# Altium project labrador.PrjPCB
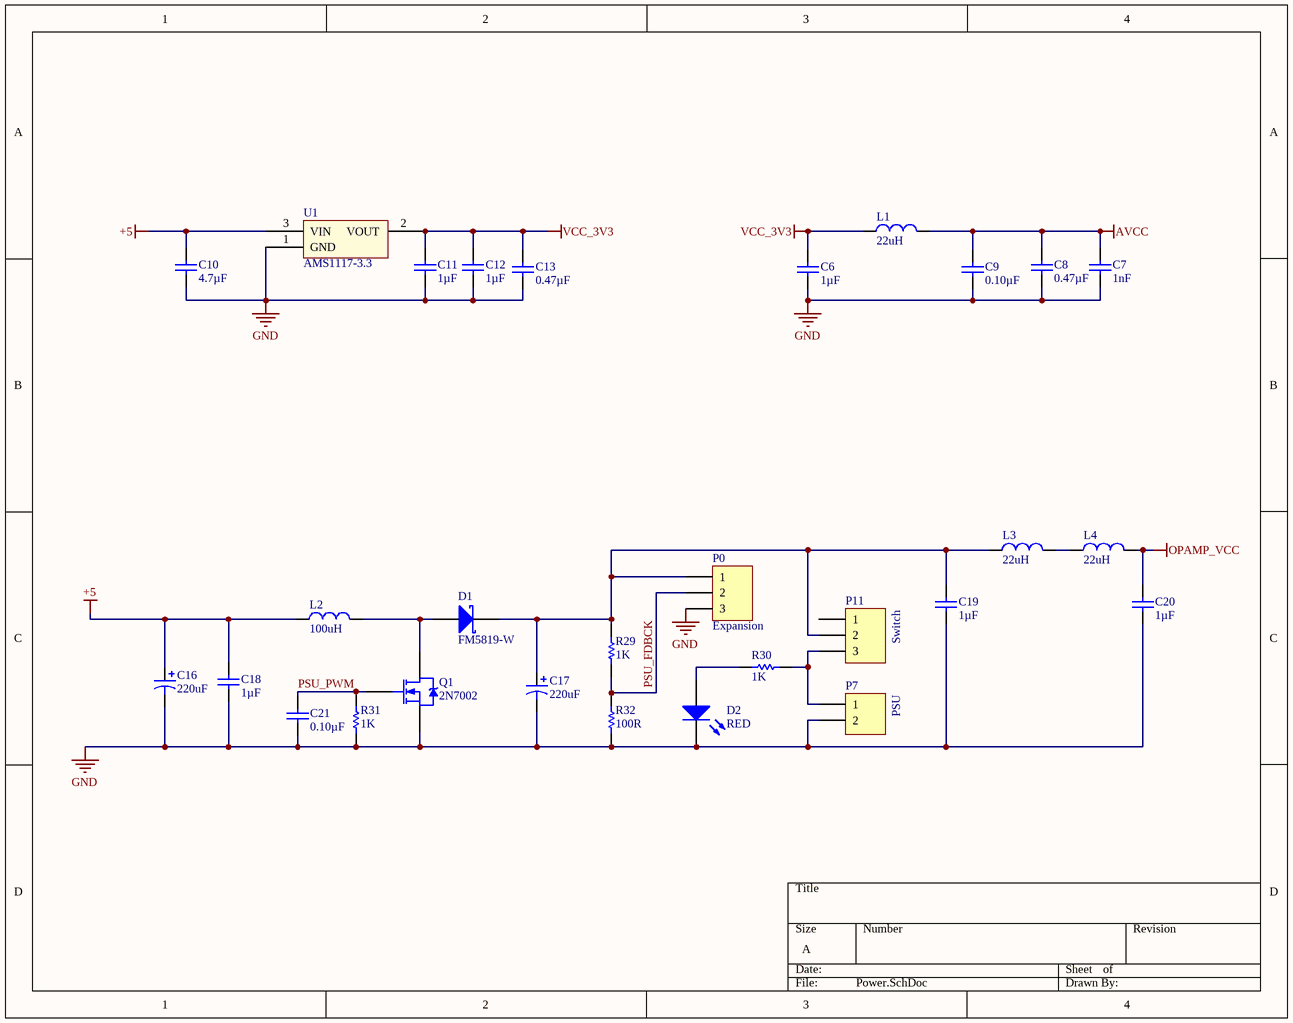
[diagram p0: Power.SchDoc]
3 sheets, 76 parts. Net scope: global (net labels, ports and power ports of the same name join across sheets).
Board file: PCB.PcbDoc
Sheets:
  Power.SchDoc
  Labrador.SchDoc
  Analog.SchDoc

## Sheet Power.SchDoc
size A

### Parts
C6  1µF  [CAPC200X125X75L45N]
C7  1nF  [CAPC200X125X75L45N]
C8  0.47µF  [CAPC200X125X75L45N]
C9  0.10µF  [CAPC200X125X75L45N]
C10  4.7µF  [CAPC200X125X75L45N]
C11  1µF  [CAPC200X125X75L45N]
C12  1µF  [CAPC200X125X75L45N]
C13  0.47µF  [CAPC200X125X75L45N]
C16  value 220uF  [Cap_Elec_47uF]  (hidden comment: CAP_POLAR)
C17  value 220uF  [Cap_Elec_47uF]  (hidden comment: CAP_POLAR)
C18  1µF  [CAPC200X125X75L45N]
C19  1µF  [CAPC200X125X75L45N]
C20  1µF  [CAPC200X125X75L45N]
C21  0.10µF  [CAPC200X125X75L45N]
D1  FM5819-W  [DIOM470X266X220L114X139N]
D2  RED  [LEDC200X125X38L45N]
L1  22uH  [CAPC200X125X140L45N]
L2  100uH  [CD54-Modified]
L3  22uH  [CAPC200X125X140L45N]
L4  22uH  [CAPC200X125X140L45N]
P0  Expansion  [HDR1X3]
P7  PSU  [HDR1X2]
P11  Switch  [HDR1X3]
Q1  2N7002  [SOT23-3P95_230X110L30X43N]
R29  1K  [RESC200X125X50L35N]
R30  1K  [RESC200X125X50L35N]
R31  1K  [RESC200X125X50L35N]
R32  100R  [RESC200X125X50L35N]
U1  AMS1117-3.3  [SOT223-4P229_700X180L36X74N]

### Nets
+5: C10.2 C16.2 C18.2 L2.1 U1.3(VIN)
AVCC: C7.2 C8.2 C9.2 L1.2
GND: C6.1 C7.1 C8.1 C9.1 C10.1 C11.1 C12.1 C13.1 C16.1 C17.1 C18.1 C19.1 C20.1 C21.1 D2.C(K) P0.3 P7.2 Q1.2(S) R31.1 R32.1 U1.1(GND)
OPAMP_VCC: C20.2 L4.2
VCC_3V3: C6.2 C11.2 C12.2 C13.2 L1.1 U1.2(VOUT)
PSU_FDBCK: P0.2 R29.1 R32.2
PSU_PWM: C21.2 Q1.1(G) R31.2
NetC17_2: C17.2 C19.2 D1.C L3.1 P0.1 P11.2 R29.2
NetD1_A: D1.A L2.2 Q1.3(D)
NetD2_A: D2.A R30.1
NetL3_2: L3.2 L4.1
NetP7_1: P7.1 P11.3 R30.2

Not connected (* = marked no-connect by the designer): P11 1

### Library data of the parts
C6 C11 C12 C18-C20 = 885012107015: 1µF 25V Ceramic Capacitor X5R 0805 (2012 Metric) 0.079" L x 0.049" W (2.00mm x 1.25mm); Manufacturer: Wurth Electronics; Capacitance: 1uF; Tolerance: 20%; Supplier 1: Farnell; Manufacturer Part Number: 885012107015; Stock 1: 0; Mount: Surface Mount; Case/Package: 0805; Case Code (Metric): 2012; Case Code (Imperial): 0805; Min Operating Temperature: -55°C; Max Operating Temperature: 85°C; Packaging: Tape and Reel; Voltage Rating: 25V; Length: 0.079inch; Width: 0.049inch; Thickness: 0.053inch
C7 = 885012207033: 1000pF 16V Ceramic Capacitor X7R 0805 (2012 Metric) 0.079" L x 0.049" W (2.00mm x 1.25mm); Manufacturer: Wurth Electronics; Tolerance: 10%; Supplier 1: Newark; Manufacturer Part Number: 885012207033; Stock 1: 3260; Pricing 1: 10=0.035, 25=0.034, 50=0.032, 100=0.031, 250=0.03, 500=0.028 (USD); Mount: Surface Mount; Case/Package: 0805; Case Code (Metric): 2012; Case Code (Imperial): 0805; Min Operating Temperature: -55°C; Max Operating Temperature: 125°C; Packaging: Tape and Reel; Capacitance: 1nF; Voltage Rating: 16V; Length: 0.079inch; Width: 0.049inch; Thickness: 0.035inch
C8 C13 = 885012207020: 0.47µF 10V Ceramic Capacitor X7R 0805 (2012 Metric) 0.079" L x 0.049" W (2.00mm x 1.25mm); Manufacturer: Wurth Electronics; Capacitance: 470nF; Tolerance: 10%; Supplier 1: Newark; Manufacturer Part Number: 885012207020; Stock 1: 2295; Pricing 1: 5=0.11, 10=0.098, 25=0.095, 50=0.091, 100=0.088, 250=0.083, 500=0.078 (USD); Mount: Surface Mount; Case/Package: 0805; Case Code (Metric): 2012; Case Code (Imperial): 0805; Min Operating Temperature: -55°C; Max Operating Temperature: 125°C; Packaging: Tape and Reel; Voltage Rating: 10V; Length: 0.079inch; Width: 0.049inch; Thickness: 0.053inch
C9 C21 = 885012207016: 0.10µF 10V Ceramic Capacitor X7R 0805 (2012 Metric) 0.079" L x 0.049" W (2.00mm x 1.25mm); Manufacturer: Wurth Electronics; Capacitance: 100nF; Tolerance: 10%; Supplier 1: Mouser; Manufacturer Part Number: 885012207016; Stock 1: 13980; Pricing 1: 1=0.1, 10=0.045, 50=0.045, 100=0.04, 1000=0.035, 10000=0.035 (USD); Mount: Surface Mount; Case/Package: 0805; Case Code (Metric): 2012; Case Code (Imperial): 0805; Min Operating Temperature: -55°C; Max Operating Temperature: 125°C; Packaging: Cut Tape; Voltage Rating: 10V; Length: 0.079inch; Width: 0.049inch; Thickness: 0.035inch
C10 = 885012107013: 4.7µF 16V Ceramic Capacitor X5R 0805 (2012 Metric) 0.079" L x 0.049" W (2.00mm x 1.25mm); Manufacturer: Wurth Electronics; Capacitance: 4.7uF; Tolerance: 20%; Supplier 1: Farnell; Manufacturer Part Number: 885012107013; Stock 1: 0; Mount: Surface Mount; Case/Package: 0805; Case Code (Metric): 2012; Case Code (Imperial): 0805; Min Operating Temperature: -55°C; Max Operating Temperature: 85°C; Packaging: Tape and Reel; Voltage Rating: 16V; Length: 0.079inch; Width: 0.049inch; Thickness: 0.057inch
C16 C17 = CAP_POLAR: Aluminium Electrolyte 16V max
D1 = FM5819-W: Schottky Diodes & Rectifiers Vr/40V Io/1A T/R; Manufacturer: Rectron; Max Surge Current: 25A; Element Configuration: Single; Max Reverse Leakage Current: 200uA; Supplier 1: Mouser; Manufacturer Part Number: FM5819-W; Stock 1: 20026; Pricing 1: 1=0.15, 10=0.15, 50=0.13, 100=0.1, 1000=0.072, 10000=0.042 (USD); Min Operating Temperature: -55°C; Max Operating Temperature: 150°C; Package Quantity: 5000; Packaging: Tape and Reel
D2 = LH R974-LP-1: LED RED DIFFUSED 0805 SMD; Manufacturer: OSRAM Opto Semiconductors Inc.; Lens Color: White; Millicandela Rating: 41mcd; Lens Style/Size: Rectangle with Flat Top, 1.30mm x 1.25mm; Voltage - Forward (Vf) (Typ): 1.8V; Current - Test: 20mA; Viewing Angle: 160°; Wavelength - Dominant: 645nm; Wavelength - Peak: 660nm; Supplier 1: Digi-Key; Manufacturer Part Number: LH R974-LP-1; RoHS: RoHS Compliant; Category: Optoelectronics; Stock 1: 128309; Pricing 1: 1=0.25, 10=0.18, 25=0.1328, 100=0.0948, 250=0.06448, 500=0.0569, 1000=0.04457 (USD); Packaging: Cut Tape (CT); Part Status: Active; Color: Red; Lens Transparency: Diffused; Mounting Type: Surface Mount; Features: -; Package / Case: 0805 (2012 Metric); Size / Dimension: 2.00mm L x 1.25mm W; Height (Max): 0.90mm; ComponentLink1URL: http://www.osram-os.com/Graphics/XPic8/00078869_0.pdf; ComponentLink1Description: http://www.osram-os.com/Graphics/XPic8/00078869_0.pdf
L1 L3 L4 = LBC2016T220M: Fixed Inductor 22uH 20% 165mA; Supplier 1: Arrow
L2 = CD75NP-331KC: FIXED IND 100uH 400MA 1.26 OHM; Manufacturer: Sumida America Components Inc.; Material - Core: Ferrite; Inductance: 330µH; Tolerance: ±10%; Shielding: Unshielded; DC Resistance (DCR): 1.26 Ohm Max; Supplier 1: Digi-Key; Manufacturer Part Number: CD75NP-331KC; RoHS: RoHS Compliant; Category: Inductors, Coils, Chokes; Stock 1: 0; Pricing 1: 500=0.504 (USD); Packaging: Tape & Reel (TR); Part Status: Active; Type: -; Current Rating: 400mA; Current - Saturation: -; Q @ Freq: -; Frequency - Self Resonant: -; Ratings: -; Operating Temperature: -40°C ~ 100°C; Mounting Type: Surface Mount; Package / Case: Nonstandard; Supplier Device Package: -; Size / Dimension: 0.307" L x 0.276" W (7.80mm x 7.00mm); Height - Seated (Max): 0.217" (5.50mm); ComponentLink1URL: http://products.sumida.com/products/pdf/CD75.pdf; ComponentLink1Description: http://products.sumida.com/products/pdf/CD75.pdf
P0 P11 = Header 3: Header, 3-Pin; LatestRevisionDate: 17-Jul-2002; LatestRevisionNote: Re-released for DXP Platform.; Publisher: Altium Limited
P7 = Header 2: Header, 2-Pin; LatestRevisionDate: 17-Jul-2002; LatestRevisionNote: Re-released for DXP Platform.; Publisher: Altium Limited
Q1 = 2N7002LT1G: MOSFET N-CH 60V 0.115A SOT-23; Manufacturer: ON Semiconductor; FET Type: N-Channel; Current - Continuous Drain (Id) @ 25°C: 115mA (Tc); Drive Voltage (Max Rds On,  Min Rds On): 5V, 10V; Vgs(th) (Max) @ Id: 2.5V @ 250µA; Input Capacitance (Ciss) (Max) @ Vds: 50pF @ 25V; Vgs (Max): ±20V; Power Dissipation (Max): 225mW (Ta); Rds On (Max) @ Id, Vgs: 7.5 Ohm @ 500mA, 10V; Supplier 1: Digi-Key; Manufacturer Part Number: 2N7002LT1G; RoHS: RoHS Compliant; Category: Discrete Semiconductor Products; Stock 1: 446807; Pricing 1: 1=0.14, 10=0.129, 100=0.0704, 500=0.0433, 1000=0.02952 (USD); Packaging: Cut Tape (CT); Part Status: Active; Technology: MOSFET (Metal Oxide); Drain to Source Voltage (Vdss): 60V; Gate Charge (Qg) (Max) @ Vgs: -; FET Feature: -; Operating Temperature: -55°C ~ 150°C (TJ); Mounting Type: Surface Mount; Supplier Device Package: SOT-23-3 (TO-236); Package / Case: TO-236-3, SC-59, SOT-23-3; ComponentLink1URL: http://www.onsemi.com/pub_link/Collateral/2N7002L-D.PDF; ComponentLink1Description: http://www.onsemi.com/pub_link/Collateral/2N7002L-D.PDF
R29-R31 = RC0805FR-071KL: RES SMD 1K OHM 1% 1/8W 0805; Manufacturer: Yageo; Power (Watts): 0.125W, 1/8W; Temperature Coefficient: ±100ppm/°C; Supplier 1: Digi-Key; Manufacturer Part Number: RC0805FR-071KL; RoHS: RoHS Compliant; Category: Resistors; Stock 1: 6960895; Pricing 1: 1=0.1, 10=0.019, 25=0.0136, 50=0.0104, 100=0.0077, 250=0.00584, 500=0.00468, 1000=0.00345 (USD); Packaging: Cut Tape (CT); Part Status: Active; Resistance (Ohms): 1k; Tolerance: ±1%; Composition: Thick Film; Features: Moisture Resistant; Operating Temperature: -55°C ~ 155°C; Package / Case: 0805 (2012 Metric); Supplier Device Package: 0805; Size / Dimension: 0.079" L x 0.049" W (2.00mm x 1.25mm); Height - Seated (Max): 0.024" (0.60mm); Number of Terminations: 2; Failure Rate: -; ComponentLink1URL: http://www.yageo.com/NewPortal/yageodocoutput?fileName=/pdf/R-Chip/PYu-RC_Group_51_RoHS_L_4.pdf; ComponentLink1Description: http://www.yageo.com/NewPortal/yageodocoutput?fileName=/pdf/R-Chip/PYu-RC_Group_51_RoHS_L_4.pdf
R32 = RC0805JR-07100RL: YAGEO         RC0805JR-07100RL             RES, THICK FILM, 100R, 5%, 0.125W, 0805; Temperature Coefficient: 100ppm/°C; Power Rating: 125mW; Voltage Rating: 150V; Supplier 1: Future Electronics; Manufacturer: Yageo; Manufacturer Part Number: RC0805JR-07100RL; Stock 1: 0; Case/Package: 0805; Contact Plating: Lead,Matte,Tin; Case Code (Imperial): 0805; Case Code (Metric): 2012; Min Operating Temperature: -55°C; Max Operating Temperature: 155°C; Tolerance: 5%; Resistance: 100R; Composition: Thick Film; Packaging: Tape and Reel; Termination: SMD/SMT; Radiation Hardening: No; REACH SVHC: Unknown; Lead Free: Lead Free; ComponentLink1URL: http://www.farnell.com/datasheets/444164.pdf; ComponentLink1Description: http://www.farnell.com/datasheets/444164.pdf; ComponentLink2URL: http://www.farnell.com/datasheets/2167052.pdf; ComponentLink2Description: http://www.farnell.com/datasheets/2167052.pdf; ComponentLink3URL: http://www.farnell.com/datasheets/442941.pdf; ComponentLink3Description: http://www.farnell.com/datasheets/442941.pdf; ComponentLink4URL: http://www.yageo.ru/pdf/RC0805.pdf; ComponentLink4Description: http://www.yageo.ru/pdf/RC0805.pdf
U1 = AMS1117-3.3: Linear Reg 3.3, 1.2V dropout

## Sheet Labrador.SchDoc
size A
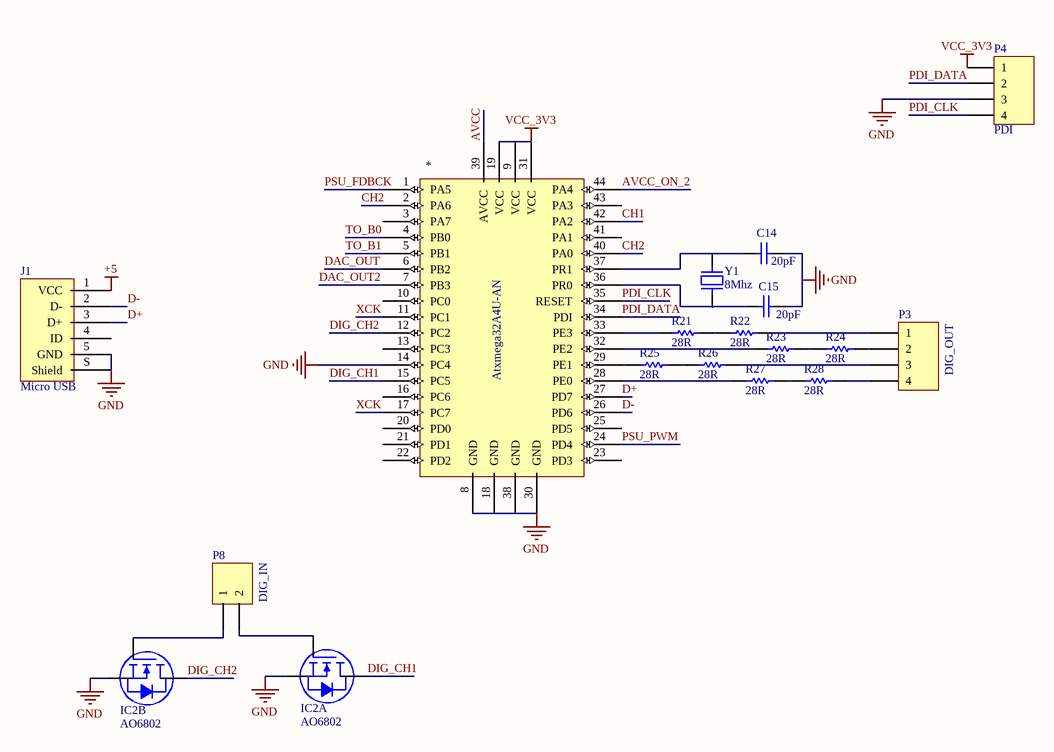
[diagram p1: Labrador.SchDoc]

### Parts
*  Atxmega32A4U-AN  [QFP44P80_1200X1200X120L60X37N]
C14  20pF  [CAPC200X125X75L45N]
C15  20pF  [CAPC200X125X75L45N]
IC2  AO6802  [ALPHAOMEGA TSOP-6]  (parts A,B of 2)
J1  Micro USB  [FCI USB 10118193-0001LF]
P3  DIG_OUT  [HDR1X4]
P4  PDI  [HDR1X4]
P8  DIG_IN  [HDR1X2]
R21  28R  [RESC160X80X55L25N]
R22  28R  [RESC160X80X55L25N]
R23  28R  [RESC160X80X55L25N]
R24  28R  [RESC160X80X55L25N]
R25  28R  [RESC160X80X55L25N]
R26  28R  [RESC160X80X55L25N]
R27  28R  [RESC160X80X55L25N]
R28  28R  [RESC160X80X55L25N]
Y1  8Mhz  [TXC 9C]

### Nets
+5: J1.1(VCC)
AVCC: *.39(AVCC)
GND: *.8(GND) *.14(PC4) *.18(GND) *.30(GND) *.38(GND) C14.2 C15.2 IC2.2(S2) IC2.5(S1) J1.5(GND) J1.S(Shield) P4.3
VCC_3V3: *.9(VCC) *.19(VCC) *.31(VCC) P4.1
AVCC_ON_2: *.44(PA4)
CH1: *.42(PA2)
CH2: *.2(PA6) *.40(PA0)
D+: *.27(PD7) J1.3(D+)
D-: *.26(PD6) J1.2(D-)
DAC_OUT: *.6(PB2)
DAC_OUT2: *.7(PB3)
DIG_CH1: *.15(PC5) IC2.6(D1)
DIG_CH2: *.12(PC2) IC2.4(D2)
PDI_CLK: *.35(RESET) P4.4
PDI_DATA: *.34(PDI) P4.2
PSU_FDBCK: *.1(PA5)
PSU_PWM: *.24(PD4)
TO_B0: *.4(PB0)
TO_B1: *.5(PB1)
XCK: *.11(PC1) *.17(PC7)
Net*_28: *.28(PE0) R27.1
Net*_29: *.29(PE1) R25.1
Net*_32: *.32(PE2) R23.1
Net*_33: *.33(PE3) R21.1
Net*_36: *.36(PR0) C15.1 Y1.1
Net*_37: *.37(PR1) C14.1 Y1.2
NetIC2_1: IC2.1(G1) P8.2
NetIC2_3: IC2.3(G2) P8.1
NetP3_1: P3.1 R22.2
NetP3_2: P3.2 R24.2
NetP3_3: P3.3 R26.2
NetP3_4: P3.4 R28.2
NetR21_2: R21.2 R22.1
NetR23_2: R23.2 R24.1
NetR25_2: R25.2 R26.1
NetR27_2: R27.2 R28.1

Not connected (* = marked no-connect by the designer): * 3(PA7) 10(PC0) 13(PC3) 16(PC6) 20(PD0) 21(PD1) 22(PD2) 23(PD3) 25(PD5) 41(PA1) 43(PA3); J1 4(ID)

### Library data of the parts
C14 C15 = CL21C180JBANNNC: CAP CER 20PF 50V NP0 0805; Manufacturer: Samsung Electro-Mechanics America, Inc.; Capacitance: 18pF; Tolerance: ±5%; Temperature Coefficient: C0G, NP0; Supplier 1: Digi-Key; Manufacturer Part Number: CL21C180JBANNNC; RoHS: RoHS Compliant; Category: Capacitors; Stock 1: 151885; Pricing 1: 1=0.1, 10=0.044, 25=0.032, 50=0.024, 100=0.0196, 250=0.0164, 500=0.014, 1000=0.011 (USD); Packaging: Digi-Reel®; Part Status: Active; Voltage - Rated: 50V; Operating Temperature: -55°C ~ 125°C; Features: -; Ratings: -; Applications: General Purpose; Mounting Type: Surface Mount, MLCC; Package / Case: 0805 (2012 Metric); Size / Dimension: 0.079" L x 0.049" W (2.00mm x 1.25mm); Height - Seated (Max): -; Thickness (Max): 0.030" (0.75mm); Lead Spacing: -; Lead Style: -; ComponentLink1URL: http://www.samsungsem.com/kr/support/product-search/mlcc/__icsFiles/afieldfile/2016/08/18/S_CL21C180JBANNNC.pdf; ComponentLink1Description: http://www.samsungsem.com/kr/support/product-search/mlcc/__icsFiles/afieldfile/2016/08/18/S_CL21C180JBANNNC.pdf; Supplier Part Number 1: 1276-1107-6-ND
IC2 = ALPHAOMEGA TSOP-6: MOSFET 2N-CH 30V 3.5A 6-TSOP; Manufacturer: Alpha & Omega; Rds On (Max) at Id, Vgs: 50 mOhm @ 3.5A, 10V; Vgs(th) (Max) at Id: 2.5V @ 250µA; Gate Charge (Qg): 5nC @ 10V; Input Capacitance (Ciss) at Vds: 210pF @ 15V; Power - Max: 1.15W; Part Number: AO6802; PartId: 9696; Supplier 1: Digi-Key; Supplier Part Number 1: 785-1082-1-ND; ComponentLink1Description: Datasheet; ComponentLink1URL: http://aosmd.com/res/data_sheets/AO6802.pdf; ComponentLink2Description: Digi-Key Listing; ComponentLink2URL: https://www.digikey.com/product-detail/en/alpha-omega-semiconductor-inc/AO6802/785-1082-1-ND/1856025; Price: 0.17; Type: 2 N-Channel (Dual); Device Package: SC-74, SOT-457; Drain to Source Voltage (Vdss): 30V; Features: Logic Level Gate; Current Continuous Drain: 3.5A
J1 = USB 2.0 Type B Micro: CONN USB MICRO B RECPT SMT R/A; Part Number: 10118193-0001LF; Manufacturer: FCI; Number Of Positions: 5; PartId: 7864; Supplier 1: Digi-Key; Supplier Part Number 1: 609-4616-2-ND; ComponentLink1Description: Datasheet; ComponentLink1URL: http://portal.fciconnect.com/Comergent//fci/drawing/10118193.pdf; ComponentLink2Description: Digi-Key Listing; ComponentLink2URL: http://www.digikey.ca/product-detail/en/10118193-0001LF/609-4616-2-ND/2785388; Price: 0.2823; Type: USB - micro B; Series: USB 2.0
P3 P4 = Header 4: Header, 4-Pin; LatestRevisionDate: 17-Jul-2002; LatestRevisionNote: Re-released for DXP Platform.; Publisher: Altium Limited
P8 = Header 2: Header, 2-Pin; LatestRevisionDate: 17-Jul-2002; LatestRevisionNote: Re-released for DXP Platform.; Publisher: Altium Limited
R21-R28 = RC0603FR-0728RL: RES SMD 28 OHM 1% 1/10W 0603; Manufacturer: Yageo; Temperature Coefficient: 100ppm/°C; Power Rating: 100mW; Voltage Rating: 50V; Supplier 1: Future Electronics; Manufacturer Part Number: RC0603FR-0728RL; Stock 1: 0; Case/Package: 0603; Contact Plating: Matte,Tin; Case Code (Metric): 1608; Case Code (Imperial): 0603; Min Operating Temperature: -55°C; Max Operating Temperature: 155°C; Resistance: 28R; Tolerance: 1%; Composition: Thick Film; Package Quantity: 1; Packaging: Tape and Reel; Number of Terminations: 2; Termination: SMD/SMT; Military Standard: Not; Max Power Dissipation: 100mW; Voltage Rating (DC): 50V; Features: Moisture Resistant; Length: 0.063inch; Height: 0.022inch; Width: 0.031inch; Depth: 0.8mm; Lead Free: Lead Free; ComponentLink1URL: http://www.yageo.com/documents/recent/PYu-RC_Group_51_RoHS_L_9.pdf; ComponentLink1Description: http://www.yageo.com/documents/recent/PYu-RC_Group_51_RoHS_L_9.pdf; ComponentLink2URL: http://www.yageo.com/documents/recent/PYu-RC0603_51_RoHS_L_4.pdf; ComponentLink2Description: http://www.yageo.com/documents/recent/PYu-RC0603_51_RoHS_L_4.pdf
Y1 = ATS08ASM-1: Crystals 8MHz 20pF; Manufacturer: CTS; Frequency Tolerance: 30ppm; ESR (Equivalent Series Resistance): 60R; Frequency Stability: 50ppm; Supplier 1: Future Electronics; Manufacturer Part Number: ATS08ASM-1; Stock 1: 0; Mount: Surface Mount; Min Operating Temperature: -20°C; Max Operating Temperature: 70°C; Frequency: 8MHz; Load Capacitance: 20pF; Packaging: Tape and Reel; Series Resistance: 60R; Package Quantity: 1000; Tolerance: 30ppm; Termination: SMD/SMT; Length: 0.437inch; Height: 0.169inch; Width: 4.83mm; Radiation Hardening: No; Lead Free: Lead Free; ComponentLink1URL: http://www.ctscorp.com/wp-content/uploads/ATS-ATSSM.pdf; ComponentLink1Description: http://www.ctscorp.com/wp-content/uploads/ATS-ATSSM.pdf; ComponentLink2URL: https://www.ctscorp.com/wp-content/uploads/ATS-ATSSM.pdf; ComponentLink2Description: https://www.ctscorp.com/wp-content/uploads/ATS-ATSSM.pdf

## Sheet Analog.SchDoc
size A
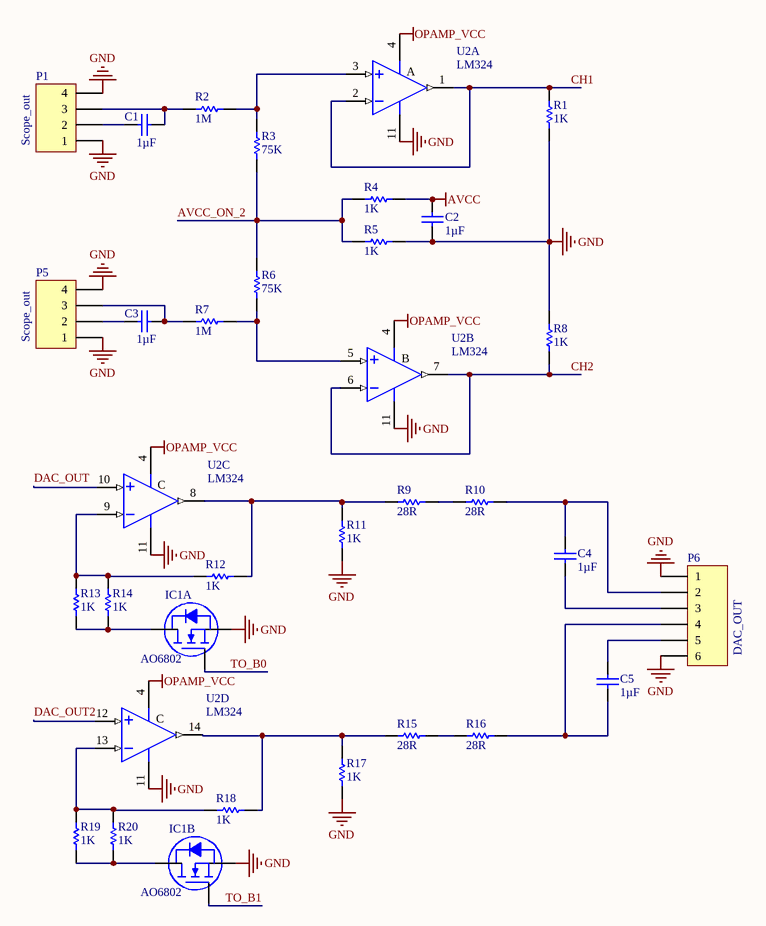
[diagram p2: Analog.SchDoc]

### Parts
C1  1µF  [CAPC200X125X75L45N]
C2  1µF  [CAPC200X125X75L45N]
C3  1µF  [CAPC200X125X75L45N]
C4  1µF  [CAPC200X125X75L45N]
C5  1µF  [CAPC200X125X75L45N]
IC1  AO6802  [ALPHAOMEGA TSOP-6]  (parts A,B of 2)
P1  Scope_out  [HDR1X4]
P5  Scope_out  [HDR1X4]
P6  DAC_OUT  [HDR1X6]
R1  1K  [RESC200X125X50L35N]
R2  1M  [RESC200X125X50L35N]
R3  75K  [RESC200X125X50L35N]
R4  1K  [RESC200X125X50L35N]
R5  1K  [RESC200X125X50L35N]
R6  75K  [RESC200X125X50L35N]
R7  1M  [RESC200X125X50L35N]
R8  1K  [RESC200X125X50L35N]
R9  28R  [RESC160X80X55L25N]
R10  28R  [RESC160X80X55L25N]
R11  1K  [RESC200X125X50L35N]
R12  1K  [RESC200X125X50L35N]
R13  1K  [RESC200X125X50L35N]
R14  1K  [RESC200X125X50L35N]
R15  28R  [RESC160X80X55L25N]
R16  28R  [RESC160X80X55L25N]
R17  1K  [RESC200X125X50L35N]
R18  1K  [RESC200X125X50L35N]
R19  1K  [RESC200X125X50L35N]
R20  1K  [RESC200X125X50L35N]
U2  LM324  [SOIC14P127_865X600X175L83X41N]  (parts A,B,C,D of 4)

### Nets
AVCC: C2.2 R4.2
GND: C2.1 IC1.2(S2) IC1.5(S1) P1.1 P1.4 P5.1 P5.4 P6.1 P6.6 R1.1 R5.2 R8.2 R11.1 R17.1 U2.11(V-)
OPAMP_VCC: U2.4(V+)
AVCC_ON_2: R3.1 R4.1 R5.1 R6.2
CH1: R1.2 U2.1(OUTA) U2.2(IN-)
CH2: R8.1 U2.6(IN-) U2.7(OUTB)
DAC_OUT: U2.10(IN+)
DAC_OUT2: U2.12(IN+)
TO_B0: IC1.1(G1)
TO_B1: IC1.3(G2)
NetC1_1: C1.1 P1.2
NetC1_2: C1.2 P1.3 R2.1
NetC3_1: C3.1 P5.2
NetC3_2: C3.2 P5.3 R7.1
NetC4_1: C4.1 P6.3
NetC4_2: C4.2 P6.2 R10.2
NetC5_1: C5.1 P6.4 R16.2
NetC5_2: C5.2 P6.5
NetIC1_4: IC1.4(D2) R19.2 R20.2
NetIC1_6: IC1.6(D1) R13.1 R14.1
NetR2_2: R2.2 R3.2 U2.3(IN+)
NetR6_1: R6.1 R7.2 U2.5(IN+)
NetR9_1: R9.1 R11.2 R12.1 U2.8(OUTC)
NetR9_2: R9.2 R10.1
NetR12_2: R12.2 R13.2 R14.2 U2.9(IN-)
NetR15_1: R15.1 R17.2 R18.2 U2.14(OUTD)
NetR15_2: R15.2 R16.1
NetR18_1: R18.1 R19.1 R20.1 U2.13(IN-)

### Notes on the sheet
- (in symbol LM324MX, part A) A
- (in symbol LM324MX, part B) B
- (in symbol LM324MX, part C) C
- (in symbol LM324MX, part D) C

### Library data of the parts
C1-C5 = 885012107015: as C6 on sheet Power; Supplier 1: Farnell; Manufacturer Part Number: 885012107015; Stock 1: 0; Mount: Surface Mount; Case/Package: 0805; Case Code (Metric): 2012; Case Code (Imperial): 0805; Min Operating Temperature: -55°C; Max Operating Temperature: 85°C; Packaging: Tape and Reel; Voltage Rating: 25V; Length: 0.079inch; Width: 0.049inch; Thickness: 0.053inch
IC1 = ALPHAOMEGA TSOP-6: as IC2 on sheet Labrador; Part Number: AO6802; PartId: 9696; Supplier 1: Digi-Key; Supplier Part Number 1: 785-1082-1-ND; ComponentLink1Description: Datasheet; ComponentLink1URL: http://aosmd.com/res/data_sheets/AO6802.pdf; ComponentLink2Description: Digi-Key Listing; ComponentLink2URL: https://www.digikey.com/product-detail/en/alpha-omega-semiconductor-inc/AO6802/785-1082-1-ND/1856025; Price: 0.17; Type: 2 N-Channel (Dual); Device Package: SC-74, SOT-457; Drain to Source Voltage (Vdss): 30V; Features: Logic Level Gate; Current Continuous Drain: 3.5A
P1 P5 = Header 4: Header, 4-Pin; LatestRevisionDate: 17-Jul-2002; LatestRevisionNote: Re-released for DXP Platform.; Publisher: Altium Limited
P6 = Header 6: Header, 6-Pin; LatestRevisionDate: 17-Jul-2002; LatestRevisionNote: Re-released for DXP Platform.; Publisher: Altium Limited
R1 R4 R5 R8 R11-R14 R17-R20 = RC0805FR-071KL: as R29 on sheet Power; Supplier 1: Digi-Key; Manufacturer Part Number: RC0805FR-071KL; RoHS: RoHS Compliant; Category: Resistors; Stock 1: 6960895; Pricing 1: 1=0.1, 10=0.019, 25=0.0136, 50=0.0104, 100=0.0077, 250=0.00584, 500=0.00468, 1000=0.00345 (USD); Packaging: Cut Tape (CT); Part Status: Active; Resistance (Ohms): 1k; Tolerance: ±1%; Composition: Thick Film; Features: Moisture Resistant; Operating Temperature: -55°C ~ 155°C; Package / Case: 0805 (2012 Metric); Supplier Device Package: 0805; Size / Dimension: 0.079" L x 0.049" W (2.00mm x 1.25mm); Height - Seated (Max): 0.024" (0.60mm); Number of Terminations: 2; Failure Rate: -; ComponentLink1URL: http://www.yageo.com/NewPortal/yageodocoutput?fileName=/pdf/R-Chip/PYu-RC_Group_51_RoHS_L_4.pdf; ComponentLink1Description: http://www.yageo.com/NewPortal/yageodocoutput?fileName=/pdf/R-Chip/PYu-RC_Group_51_RoHS_L_4.pdf
R2 R7 = RC0805JR-071ML: RES SMD 1M OHM 5% 1/8W 0805; Manufacturer: Yageo; Resistance: 1MR; Temperature Coefficient: 100ppm/°C; Power Rating: 125mW; Voltage Rating: 150V; Supplier 1: Future Electronics; Manufacturer Part Number: RC0805JR-071ML; Stock 1: 0; Case/Package: 0805; Case Code (Imperial): 0805; Case Code (Metric): 2012; Contact Plating: Lead,Matte,Tin; Min Operating Temperature: -55°C; Max Operating Temperature: 155°C; Tolerance: 5%; Composition: Thick Film; Packaging: Tape and Reel; Package Quantity: 1; Termination: SMD/SMT; Number of Terminations: 2; Military Standard: Not; Max Power Dissipation: 125mW; Features: Moisture Resistant; Length: 0.079inch; Height: 0.024inch; Width: 0.049inch; Depth: 1.25mm; Radiation Hardening: No; REACH SVHC: Unknown; Lead Free: Lead Free; ComponentLink1URL: http://www.yageo.com/documents/recent/PYu-RC_Group_51_RoHS_L_9.pdf; ComponentLink1Description: http://www.yageo.com/documents/recent/PYu-RC_Group_51_RoHS_L_9.pdf; ComponentLink2URL: http://www.yageo.ru/pdf/RC0805.pdf; ComponentLink2Description: http://www.yageo.ru/pdf/RC0805.pdf; ComponentLink3URL: http://www.farnell.com/datasheets/442941.pdf; ComponentLink3Description: http://www.farnell.com/datasheets/442941.pdf; ComponentLink4URL: http://www.farnell.com/datasheets/444164.pdf; ComponentLink4Description: http://www.farnell.com/datasheets/444164.pdf
R3 R6 = RT0805FRE0775KL: RES SMD 75K OHM 1% 1/8W 0805; Manufacturer: Yageo; Resistance: 75kR; Temperature Coefficient: 50ppm/°C; Power Rating: 125mW; Voltage Rating: 150V; Supplier 1: Arrow; Manufacturer Part Number: RT0805FRE0775KL; Stock 1: 0; Case/Package: 0805; Weight: 0.000194oz; Contact Plating: Matte,Tin; Case Code (Metric): 2012; Case Code (Imperial): 0805; Min Operating Temperature: -55°C; Max Operating Temperature: 125°C; Tolerance: 1%; Composition: Thin Film; Package Quantity: 5000; Packaging: Tape and Reel; Number of Terminations: 2; Termination: SMD/SMT; Military Standard: Not; Max Power Dissipation: 125mW; Voltage Rating (DC): 150V; Length: 2mm; Height: 0.024inch; Width: 0.049inch; Depth: 1.25mm; Radiation Hardening: No; Lead Free: Lead Free; ComponentLink1URL: http://www.yageo.com/documents/recent/PYu-RT_1-to-0.01_RoHS_L_8.pdf; ComponentLink1Description: http://www.yageo.com/documents/recent/PYu-RT_1-to-0.01_RoHS_L_8.pdf; ComponentLink2URL: http://www.mouser.com/ds/2/447/yageodocoutput-1125656.pdf; ComponentLink2Description: http://www.mouser.com/ds/2/447/yageodocoutput-1125656.pdf
R9 R10 R15 R16 = RC0603FR-0728RL: as R21 on sheet Labrador; Supplier 1: Future Electronics; Manufacturer Part Number: RC0603FR-0728RL; Stock 1: 0; Case/Package: 0603; Contact Plating: Matte,Tin; Case Code (Metric): 1608; Case Code (Imperial): 0603; Min Operating Temperature: -55°C; Max Operating Temperature: 155°C; Resistance: 28R; Tolerance: 1%; Composition: Thick Film; Package Quantity: 1; Packaging: Tape and Reel; Number of Terminations: 2; Termination: SMD/SMT; Military Standard: Not; Max Power Dissipation: 100mW; Voltage Rating (DC): 50V; Features: Moisture Resistant; Length: 0.063inch; Height: 0.022inch; Width: 0.031inch; Depth: 0.8mm; Lead Free: Lead Free; ComponentLink1URL: http://www.yageo.com/documents/recent/PYu-RC_Group_51_RoHS_L_9.pdf; ComponentLink1Description: http://www.yageo.com/documents/recent/PYu-RC_Group_51_RoHS_L_9.pdf; ComponentLink2URL: http://www.yageo.com/documents/recent/PYu-RC0603_51_RoHS_L_4.pdf; ComponentLink2Description: http://www.yageo.com/documents/recent/PYu-RC0603_51_RoHS_L_4.pdf
U2 = LM324MX: IC OPAMP GP 14SOIC; Manufacturer: ON Semiconductor / Fairchild; Min Supply Voltage: 3V; Max Supply Voltage: 32V; Min Dual Supply Voltage: 1.5V; Max Dual Supply Voltage: 16V; Voltage Gain: 100dB; Number of Channels: 4; Common Mode Rejection Ratio: 65dB; Output Current: 40mA; Input Bias Current: 250nA; Input Offset Voltage (Vos): 7mV; Nominal Supply Current: 1.2mA; Operating Supply Current: 1mA; Power Dissipation: 640mW; Min Input Voltage: -300mV; Max Frequency: 20kHz; Supplier 1: Future Electronics; Manufacturer Part Number: LM324MX; Stock 1: 0; Mount: Surface Mount; Case/Package: SOP; Number of Pins: 14; Weight: 0.2183g; Contact Plating: Matte,Tin; Min Operating Temperature: 0°C; Max Operating Temperature: 70°C; Packaging: Tape and Reel; Number of Circuits: 4; Package Quantity: 3000; Output Current per Channel: 40mA; Number of Elements: 4; Power Supply Rejection Ratio (PSRR): 65dB; Operating Supply Voltage: 32V; Number of Amplifiers: 4; Max Power Dissipation: 640mW; Max Input Voltage: 32V; Length: 8.76mm; Height: 1.65mm; Width: 4.2mm; Radiation Hardening: No; REACH SVHC: No SVHC; Lead Free: Lead Free; ComponentLink1URL: https://www.fairchildsemi.com/datasheets/LM/LM2902.pdf; ComponentLink1Description: https://www.fairchildsemi.com/datasheets/LM/LM2902.pdf; ComponentLink2URL: http://www.fairchildsemi.com/datasheets/LM/LM324.pdf; ComponentLink2Description: http://www.fairchildsemi.com/datasheets/LM/LM324.pdf; ComponentLink3URL: https://www.fairchildsemi.com/datasheets/LM/LM324.pdf; ComponentLink3Description: https://www.fairchildsemi.com/datasheets/LM/LM324.pdf; ComponentLink4URL: http://www.fairchildsemi.com/ds/LM/LM2902.pdf; ComponentLink4Description: http://www.fairchildsemi.com/ds/LM/LM2902.pdf; ComponentLink5URL: http://www.fairchildsemi.com/ds/LM/LM324.pdf; ComponentLink5Description: http://www.fairchildsemi.com/ds/LM/LM324.pdf; ComponentLink6URL: http://datasheet.iiic.cc/fairchild/LM324MX.pdf; ComponentLink6Description: http://datasheet.iiic.cc/fairchild/LM324MX.pdf

## Nets that join several sheets
+5: Power (5 pins), Labrador (J1.1)
AVCC: Power (C7.2 C8.2 C9.2 L1.2), Labrador (*.39), Analog (C2.2 R4.2)
GND: Power (21 pins), Labrador (12 pins), Analog (15 pins)
OPAMP_VCC: Power (C20.2 L4.2), Analog (U2.4)
VCC_3V3: Power (6 pins), Labrador (*.9 *.19 *.31 P4.1)
AVCC_ON_2: Labrador (*.44), Analog (R3.1 R4.1 R5.1 R6.2)
CH1: Labrador (*.42), Analog (R1.2 U2.1 U2.2)
CH2: Labrador (*.2 *.40), Analog (R8.1 U2.6 U2.7)
DAC_OUT: Labrador (*.6), Analog (U2.10)
DAC_OUT2: Labrador (*.7), Analog (U2.12)
PSU_FDBCK: Power (P0.2 R29.1 R32.2), Labrador (*.1)
PSU_PWM: Power (C21.2 Q1.1 R31.2), Labrador (*.24)
TO_B0: Labrador (*.4), Analog (IC1.1)
TO_B1: Labrador (*.5), Analog (IC1.3)